# Altium schematic sheet POWER_STAGE.SchDoc: POWER_STAGE
size A
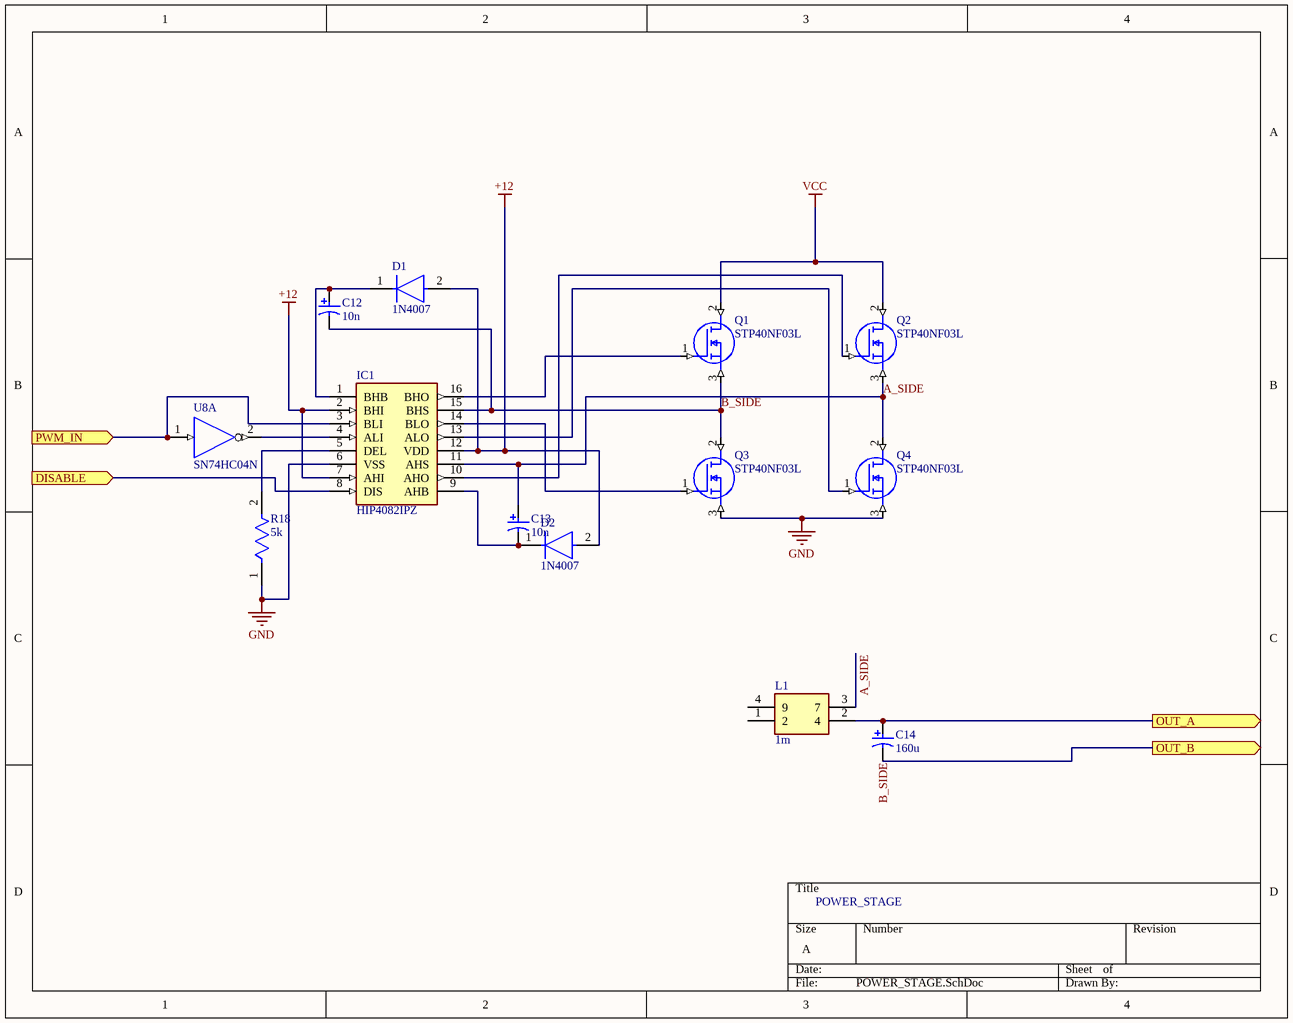
[diagram p0: POWER_STAGE.SchDoc]

## Parts
C12  10n  [PNSC-ECA-1VM221-2]
C13  10n  [PNSC-ECA-1VM221-2]
C14  160u  [PNSC-ECA-1VM221-2]
D1  1N4007  [FP-1N4007-MFG]
D2  1N4007  [FP-1N4007-MFG]
IC1  HIP4082IPZ  [DIP794W56P254L1917H533Q16N]
L1  1m  [744824101]
Q1  STP40NF03L  [TO254P470X1016X2019-3P]
Q2  STP40NF03L  [TO254P470X1016X2019-3P]
Q3  STP40NF03L  [TO254P470X1016X2019-3P]
Q4  STP40NF03L  [TO254P470X1016X2019-3P]
R18  5k  [FP-CF18-MFG]
U8  SN74HC04N  [N0014A]  (part A of 7)

## Ports
DISABLE (in), OUT_A (out), OUT_B (out), PWM_IN (in)

## Nets
+12: D1.2(A) D2.2(A) IC1.2(BHI) IC1.7(AHI) IC1.12(VDD)
GND: IC1.6(VSS) Q3.3(S) Q4.3(S) R18.1
VCC: Q1.2(D) Q2.2(D)
A_SIDE: C13.1 IC1.11(AHS) L1.3(7) Q2.3(S) Q4.2(D)
B_SIDE: C12.2 C14.2 IC1.15(BHS) Q1.3(S) Q3.2(D) ; port OUT_B
DISABLE: IC1.8(DIS) ; port DISABLE
OUT_A: C14.1 L1.2(4) ; port OUT_A
PWM_IN: IC1.3(BLI) U8.1(1A) ; port PWM_IN
NetC12_1: C12.1 D1.1(C) IC1.1(BHB)
NetC13_2: C13.2 D2.1(C) IC1.9(AHB)
NetIC1_4: IC1.4(ALI) U8.2(~{1Y})
NetIC1_5: IC1.5(DEL) R18.2
NetIC1_10: IC1.10(AHO) Q2.1(G)
NetIC1_13: IC1.13(ALO) Q4.1(G)
NetIC1_14: IC1.14(BLO) Q3.1(G)
NetIC1_16: IC1.16(BHO) Q1.1(G)

Not connected (* = marked no-connect by the designer): L1 1(2) 4(9)

## Notes on the sheet
- POWER_STAGE

## Library data of the parts
C12-C14 = CMP-2000-05311-1: Aluminum Electrolytic Capacitor, 220 uF, +/- 20%, 35 V, -40 to 85 degC, 2-Pin THD, RoHS, Bulk; Manufacturer: Panasonic; Lifetime@Temperature: 2000Hrs@85degC; Rated Voltage: 35V; Ripple Current: 350mA; Type: Radial; Capacitance: 220µF; Package Reference: ECA-1VM221; Series: M; Operating Temp Range: -40to+85degC; Package Description: 2-Pin Axial Lead, Dia 8 mm, Body Length 12.5 mm; Datasheet Version: Mar-06; Datasheet URL: https://datasheet.ciiva.com/26341/441851-da-01-en-elko-eca1vm221-m-r-220myf-35v-85c-26341906.pdf; Operating Temp-Max: 85degC; Case Size/Dimension: Ø8x11.5mm; Manufacturer URL: http://www.panasonic.com/
D1 D2 = CMP-123542-000001-1: Rectifier diode 1000 V 1 A DO-41, ,; Manufacturer: Diotec; Max Surge Forward Current: 27A; Forward Current: 1A; Max Junction Temp: +175°C; Reverse Voltage: 1000V; Value: 15pF; Peak Reverse Current: 5uA; Category: Diode; Temperature Range Low: -50°C; Automotive: No; Temperature: -50°C to +175°C; Lead Free: Yes; ComponentLink2Description: Datasheet; Max Repetitive Reverse Voltage: 1000V; ComponentLink2URL: https://datasheet.octopart.com/1N4007-Diotec-datasheet-62346875.pdf; Manufacturer Part Number: 1N4007; Device Class L3: Rectifier Diodes; Height: 2.8mm; Octopart: https://octopart.com/1n4007-diotec-4040411; Package: 1N4007; Temperature Range High: +175°C; Device Class L1: Discrete Semiconductors; Device Class L2: Diodes; RoHS: TRUE; Capacitance: 15pF; Ipc Land Pattern Name: DIOAD888W100L520D280
IC1 = HIP4082IPZ: Integrated Circuit; Manufacturer_Name: Intersil; Datasheet Link: http://www.farnell.com/datasheets/1936004.pdf; Height: 5.33mm; Manufacturer_Part_Number: HIP4082IPZ; Arrow Part Number: HIP4082IPZ; Arrow Price/Stock: https://www.arrow.com/en/products/hip4082ipz/intersil; Mouser Part Number: 968-HIP4082IPZ
L1 = 744824101: Inductor; Manufacturer_Name: Wurth Elektronik; Datasheet Link: http://docs-emea.rs-online.com/webdocs/04ac/0900766b804acf50.pdf; Manufacturer_Part_Number: 744824101; Arrow Part Number: 744824101; Mouser Part Number: 710-744824101; Mouser Price/Stock: https://www.mouser.co.uk/ProductDetail/Wurth-Elektronik/744824101?qs=AXuZnX5ayYQsR%2F4Ip96LjQ%3D%3D
Q1-Q4 = FDP7030BL: MOSFET (N-Channel); Manufacturer_Name: ON Semiconductor; Datasheet Link: https://www.mouser.de/datasheet/2/308/FDP7030BL-1305790.pdf; Height: 4.7mm; Manufacturer_Part_Number: FDP7030BL; Arrow Part Number: FDP7030BL; Arrow Price/Stock: https://www.arrow.com/en/products/fdp7030bl/on-semiconductor; Mouser Part Number: 512-FDP7030BL; Mouser Price/Stock: https://www.mouser.com/Search/Refine.aspx?Keyword=512-FDP7030BL
R18 = CMP-26528-000001-1: RES 2.2K OHM 1/8W 5% CF AXIAL; Manufacturer: Stackpole Electronics Inc; Manufacturer Part Number: CF18JT2K20; Value: 2.2kΩ; Voltage Rating: 250V; Temperature Coefficient: 0/-400ppm/°C; Power Rating: 0.125W; Composition: Carbon Film; Octopart: https://octopart.com/cf18jt2k20-stackpole+electronics-19205714; Tolerance: 5%; Series: CF; Temperature Range Low: -55°C; ComponentLink2URL: https://www.seielect.com/catalog/sei-cf_cfm.pdf; Ipc Land Pattern Name: RESAD656W65L360D200; Package: CF18; Device Class L2: Resistors; Device Class L3: Through-Hole Resistors; Resistance: 2.2kΩ; Height: 2mm; Category: Res; ComponentLink2Description: Datasheet; Lead Free: Yes; Temperature Range High: +155°C; Temperature: -55°C to +155°C; RoHS: TRUE; Device Class L1: Passive Components; Digikey Description: RES 2.2K OHM 1/8W 5% CF AXIAL; Automotive: No
U8 = CMP-1615-00892-2: Hex Inverters, N0014A, TUBE; Manufacturer: Texas Instruments; VCC(Min)(V): 2; Bits(#): 6; Technology Family: HC; tpd @ Nom Voltage(Max)(ns): 20; Output Drive (IOL/IOH)(Max)(mA): -4/4; Rating: Catalog; Voltage(Nom)(V): 5; Schmitt Trigger: No; ICC @ Nom Voltage(Max)(mA): 0.02; Input Type: CMOS; Code_JEDEC: MS-001; PackageReference: N0014A; DatasheetVersion: SCLS078F; Output Type: CMOS; VCC(Max)(V): 6; Operating Temperature Range(C): -40 to 85; Generic Part Number: SN74HC04; F @ Nom Voltage(Max)(Mhz): 20